# EAGLE design led (EAGLE 8.2.2)
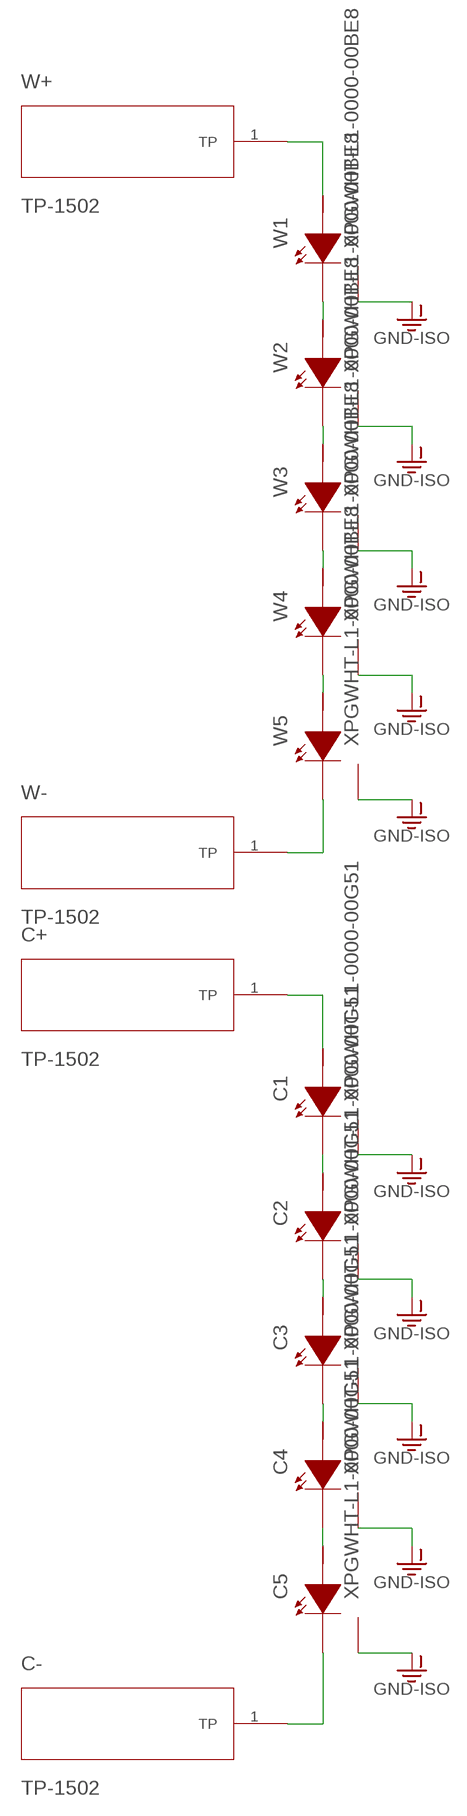
[diagram p0: schematic, sheet 1]

## Parts
C1  XPGWHT-L1-0000-00G51  [XLAMP-XPG]
C2  XPGWHT-L1-0000-00G51  [XLAMP-XPG]
C3  XPGWHT-L1-0000-00G51  [XLAMP-XPG]
C4  XPGWHT-L1-0000-00G51  [XLAMP-XPG]
C5  XPGWHT-L1-0000-00G51  [XLAMP-XPG]
C+  TP-1502  [TP-1502]
C-  TP-1502  [TP-1502]
W1  XPGWHT-L1-0000-00BE8  [XLAMP-XPG]
W2  XPGWHT-L1-0000-00BE8  [XLAMP-XPG]
W3  XPGWHT-L1-0000-00BE8  [XLAMP-XPG]
W4  XPGWHT-L1-0000-00BE8  [XLAMP-XPG]
W5  XPGWHT-L1-0000-00BE8  [XLAMP-XPG]
W+  TP-1502  [TP-1502]
W-  TP-1502  [TP-1502]

## Nets
GND-ISO: C1.GND C1.P$1(GND) C1.P$2(GND) C1.P$3(GND) C2.GND C2.P$1(GND) C2.P$2(GND) C2.P$3(GND) C3.GND C3.P$1(GND) C3.P$2(GND) C3.P$3(GND) C4.GND C4.P$1(GND) C4.P$2(GND) C4.P$3(GND) C5.GND C5.P$1(GND) C5.P$2(GND) C5.P$3(GND) W1.GND W1.P$1(GND) W1.P$2(GND) W1.P$3(GND) W2.GND W2.P$1(GND) W2.P$2(GND) W2.P$3(GND) W3.GND W3.P$1(GND) W3.P$2(GND) W3.P$3(GND) W4.GND W4.P$1(GND) W4.P$2(GND) W4.P$3(GND) W5.GND W5.P$1(GND) W5.P$2(GND) W5.P$3(GND)
N$1: C2.C C3.A
N$2: C1.C C2.A
N$3: C1.A C+.1(TP)
N$4: C5.C C-.1(TP)
N$12: W4.C W5.A
N$13: W1.C W2.A
N$14: W2.C W3.A
N$15: W3.C W4.A
N$22: C3.C C4.A
N$24: C4.C C5.A
N$30: W1.A W+.1(TP)
N$31: W5.C W-.1(TP)

## Library data of the parts
C1-C5 = derek:XPGWHT; DATASHEET_URL: http://www.cree.com/led-components/media/documents/XLampXPG.pdf; DIGIKEY_PART_NUMBER: XPGWHT-L1-0000-00G51CT-ND; PART_NUMBER: XPGWHT-L1-0000-00G51
C+ C- W+ W- = derek:TP-1502
W1-W5 = derek:XPGWHT; DATASHEET_URL: http://www.cree.com/led-components/media/documents/XLampXPG.pdf; DIGIKEY_PART_NUMBER: XPGWHT-L1-0000-00BE8CT-ND; PART_NUMBER: XPGWHT-L1-0000-00BE8

## Board
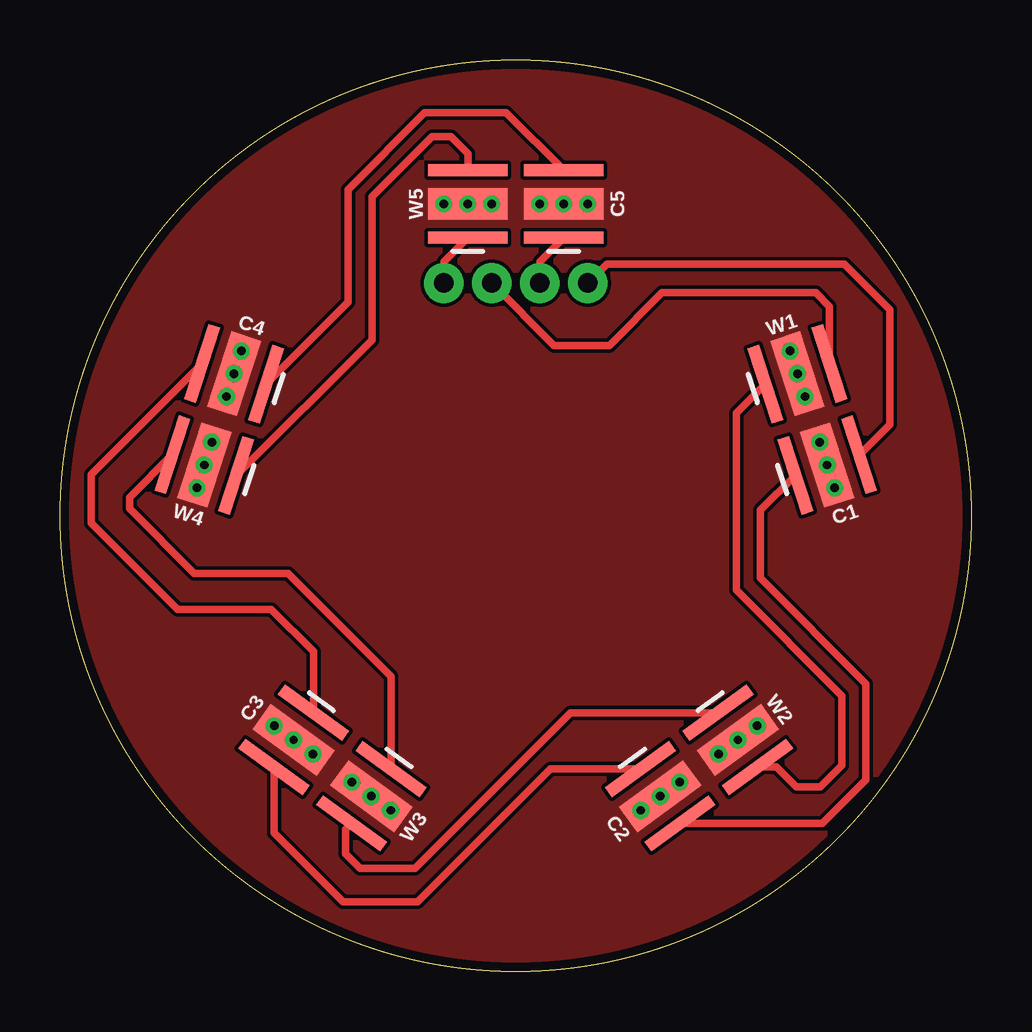
[diagram p1: board, top side]
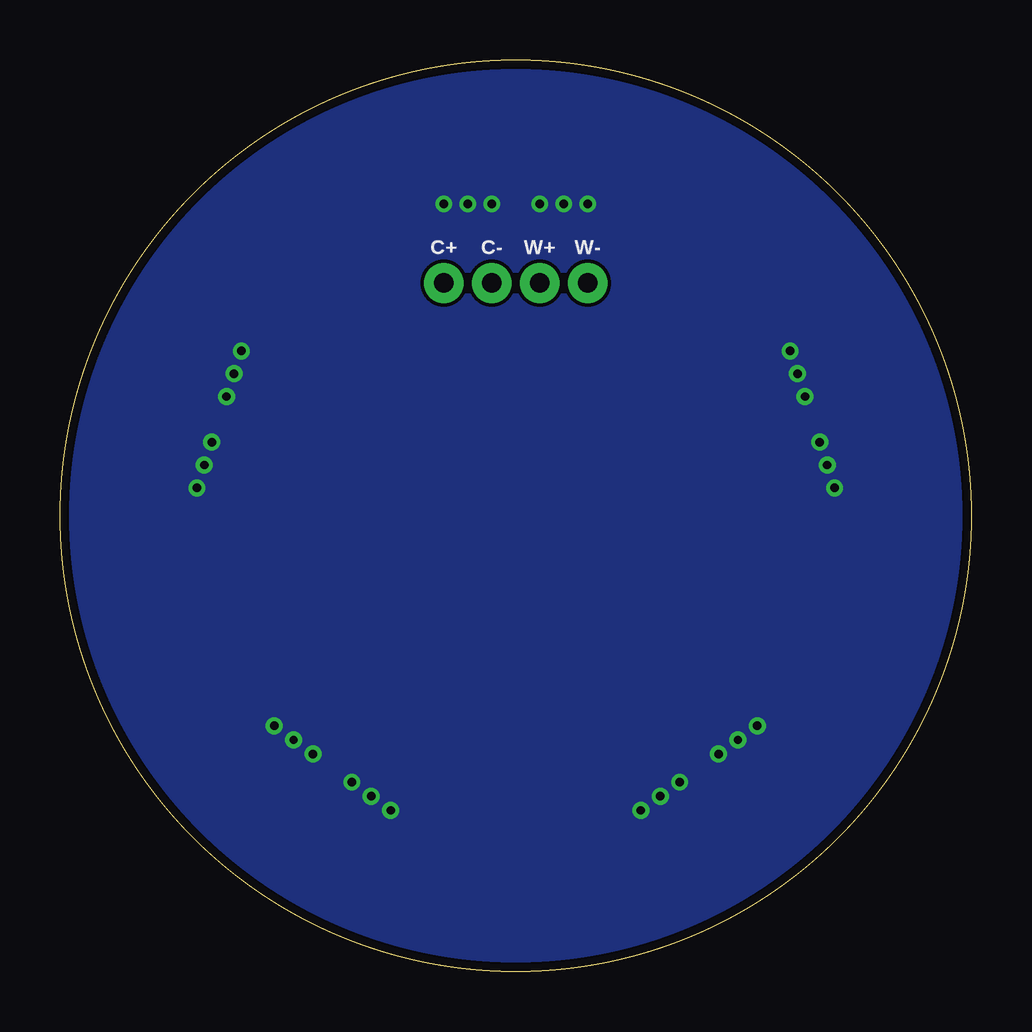
[diagram p2: board, bottom side, seen from below]

Size 38 x 38 mm. Coordinates in mm from the lower left corner, seen from the top.
Outline: circle at 19,19 radius 19
Copper layers (1*16): Top 0.0356mm / dielectric 1.5011mm / Bottom 0.0356mm
Design rules "LaenPCBOrder *": minimum track width 6mil, minimum drill 13mil, track to track 6mil, track to pad 6mil, pad to pad 6mil, via to via 6mil, smd to smd 6mil, copper to edge 15mil, drill to drill 6mil, minimum pad ring 7mil, minimum via ring 7mil, stop-mask expansion 3mil, vias tented up to drill 100mil, thermal gap 10mil

### Footprints (pad centres in the part's own frame; a part is rotated, then mirrored left to right if it is on the bottom)
XLAMP-XPG = smd 0.5 x 3.3: A 1.4,0; C -1.4,0 | smd 1.3 x 3.3: GND 0,0 | drill 0.35: P$1 0,1; P$2 0,0; P$3 0,-1
TP-1502 = drill 0.813 pad 1.651: 1 0,0

### Placement (x,y rotation side)
C1  31.98,21.12 18 top
C2  25.02,7.31 306 top
C3  9.74,9.66 234 top
C4  7.25,24.92 162 top
C5  21,32 90 top
C+  22,28.7 0 bottom
C-  20,28.7 0 bottom
W1  30.75,24.92 18 top
W2  28.26,9.66 306 top
W3  12.98,7.31 234 top
W4  6.02,21.12 162 top
W5  17,32 90 top
W+  18,28.7 0 bottom
W-  16,28.7 0 bottom

### Tracks (layer width: path | path; a pad name or v marks a point on that pad's centre or on a via)
GND-ISO
  pour Bottom (no thermals): 0,38 38,38 38,0 0,0
  pour Top (rank 3, no thermals): 0,38 38,38 38,0 0,0
N$1
  Top 0.305: C2.C 20.44,8.44 14.9,2.9 11.8,2.9 8.92,5.78 C3.A
N$2
  Top 0.305: C1.C 29.2,19.23 29.2,16.4 33.6,12 33.6,8 31.77,6.17 C2.A
N$3
  Top 0.305: C+.1 22.8,29.5 32.7,29.5 34.6,27.6 34.6,22.8 33.35,21.55 C1.A
N$4
  Top 0.305: C-.1 20,29.6 C5.C
N$12
  Top 0.305: W4.C 13,26.33 13,32.3 15.5,34.8 16.3,34.8 17,34.1 W5.A
N$13
  Top 0.305: W1.C 28.2,23.27 28.2,15.9 32.6,11.5 32.6,8.6 31.7,7.7 30.7,7.7 29.87,8.53 W2.A
N$14
  Top 0.305: W2.C 21.29,10.79 14.8,4.3 12.5,4.3 11.9,4.9 11.9,5.92 W3.A
N$15
  Top 0.305: W3.C 13.8,12.3 9.5,16.6 5.6,16.6 2.9,19.3 2.9,19.76 W4.A
N$22
  Top 0.305: C3.C 10.56,13.34 8.8,15.1 4.9,15.1 1.3,18.7 1.3,20.73 C4.A
N$24
  Top 0.305: C4.C 12,27.9 12,32.6 15.2,35.8 18.6,35.8 C5.A
N$30
  Top 0.305: W+.1 20.6,26.1 22.9,26.1 25.1,28.3 31.5,28.3 32.08,27.72 W1.A
N$31
  Top 0.305: W-.1 16,29.6 W5.C